# EasyEDA Pro project FX-50FHii_gameboy_Project.epro

# Schematic Schematic1
Create Date: 2024-07-06; Page Name: P1; Project Name: FX-50FHii gameboy; Schematic Name: Schematic1; Update Date: 2024-07-13; Company: 嘉立创EDA; Page Size: A4; Version: V1.0
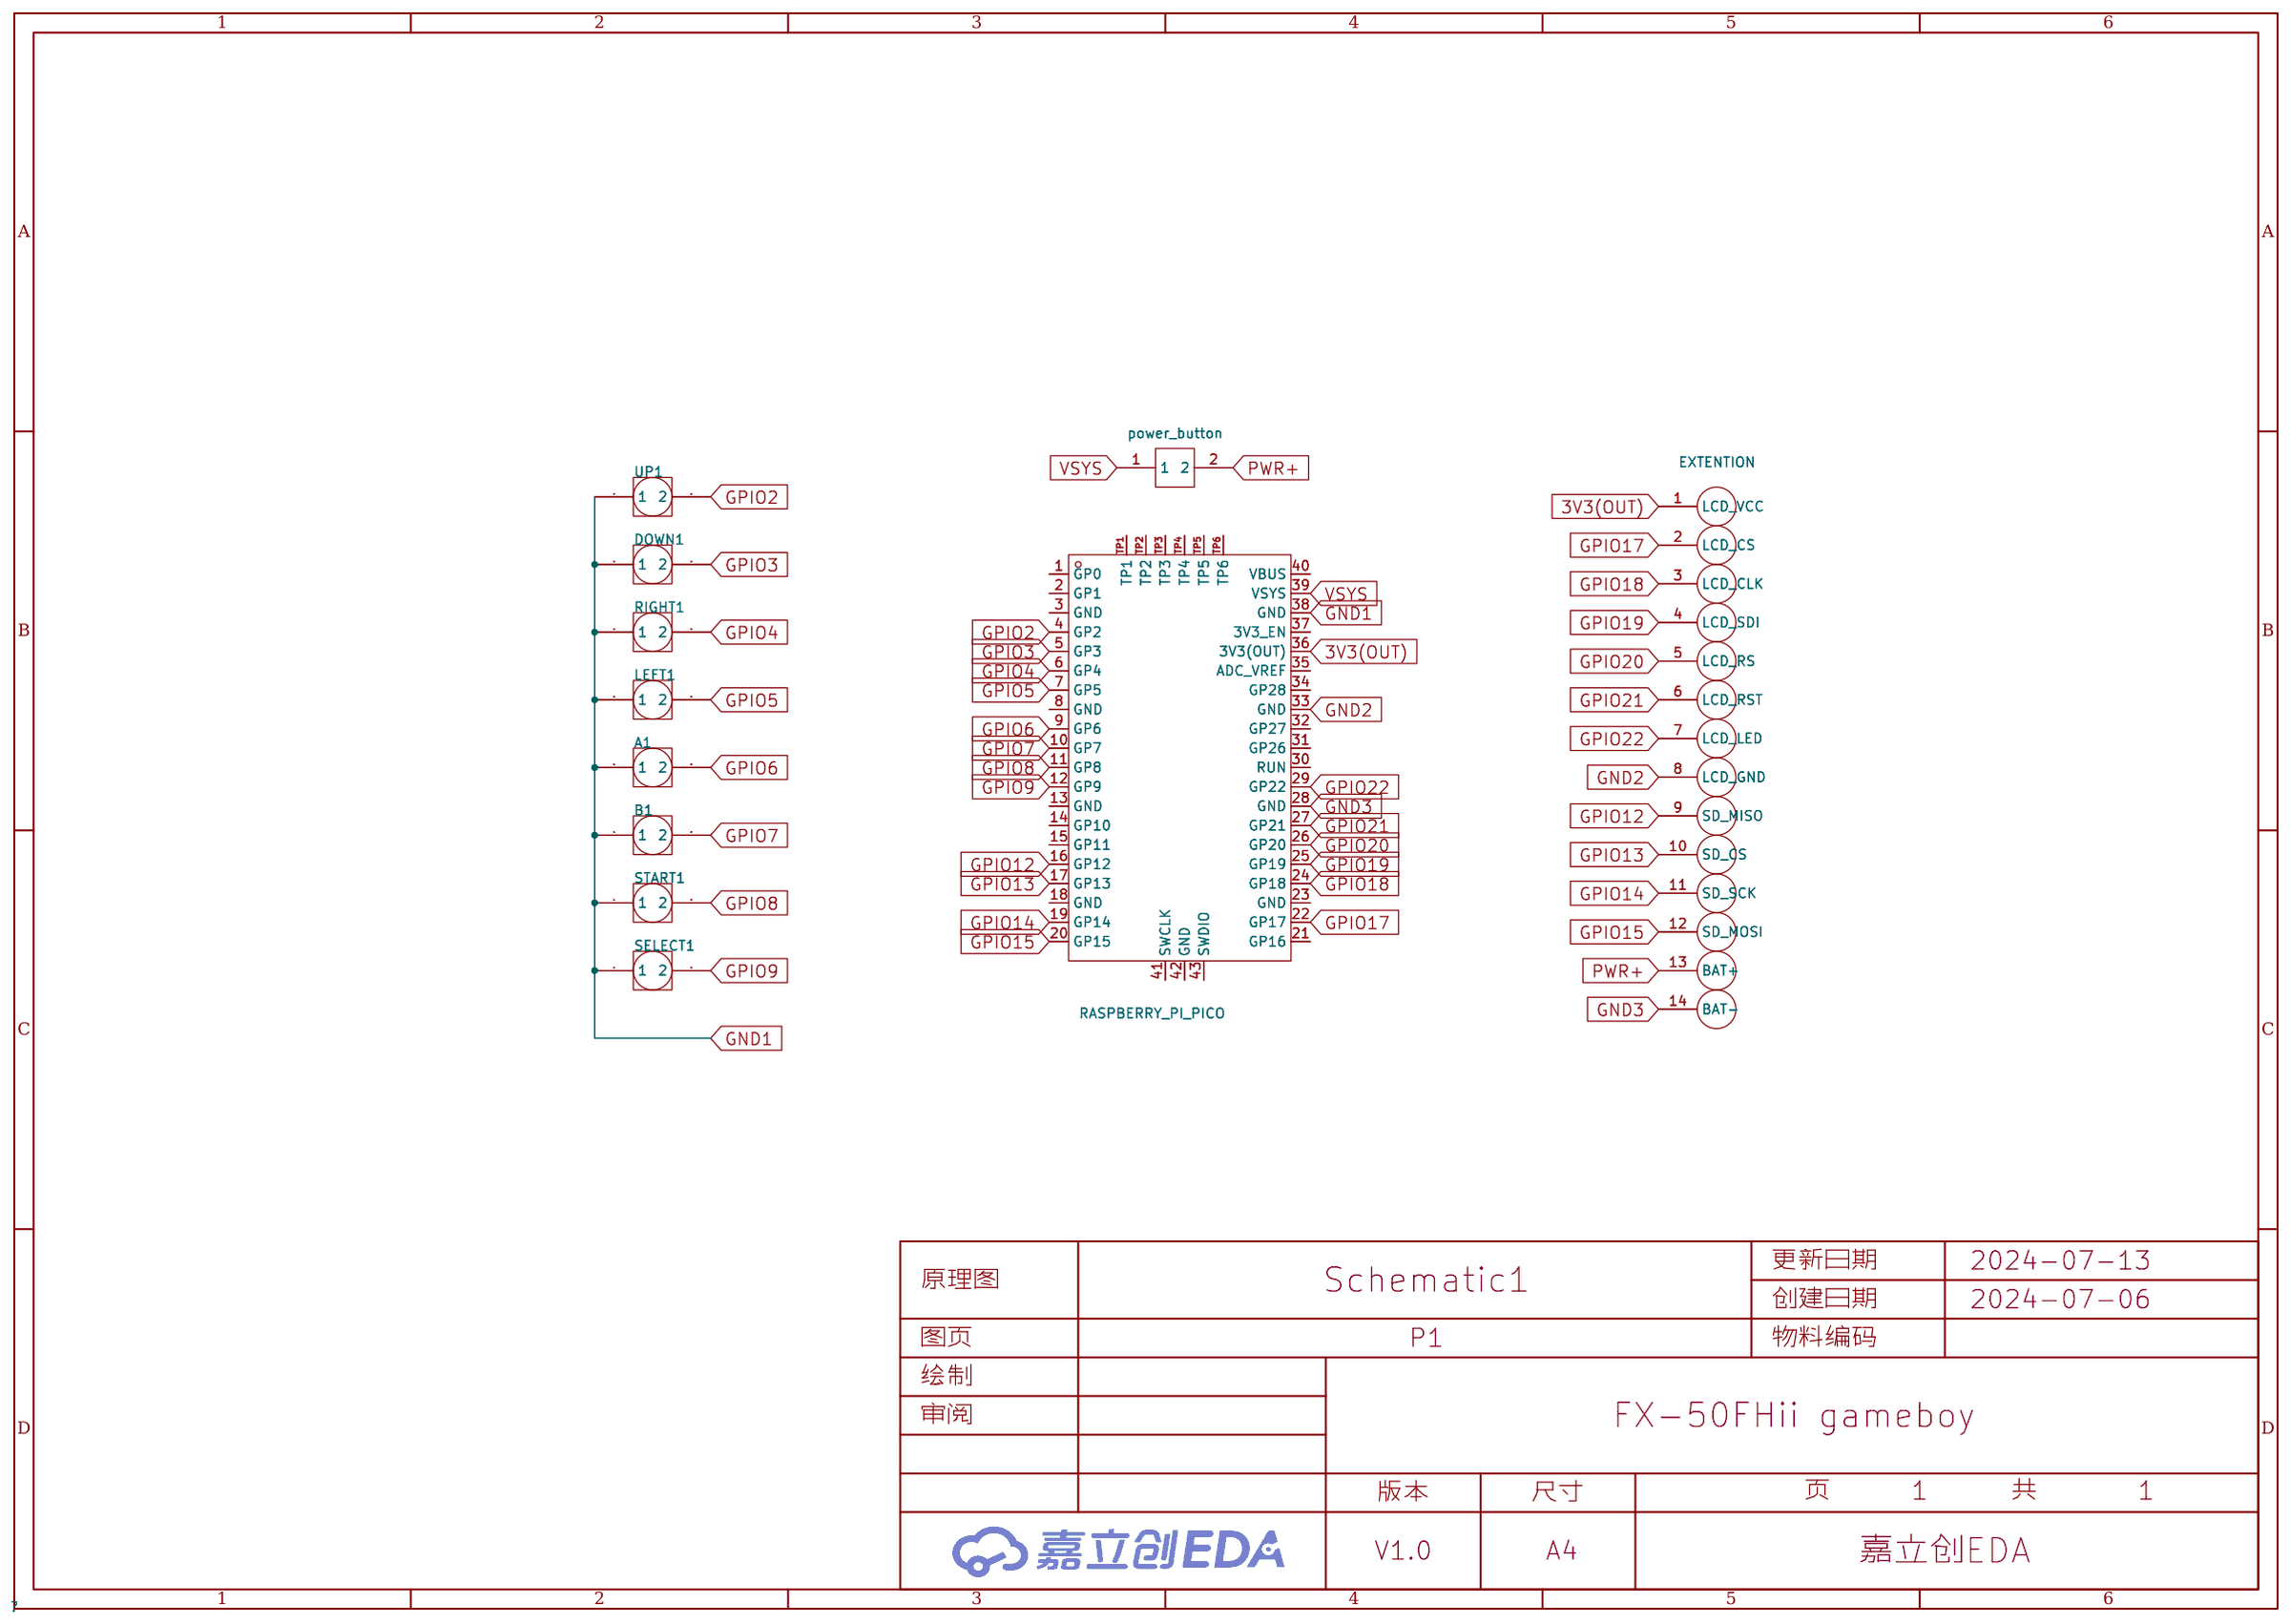
[diagram p0: schematic sheet]

## Parts
A1  -  [锅仔按键]
B1  -  [锅仔按键]
DOWN1  -  [锅仔按键]
EXTENTION  -  [CN1]  (no BOM)
LEFT1  -  [锅仔按键]
power_button  -  [自動鎖住的按鈕]
RASPBERRY_PI_PICO  -  [COMM-SMD_L51.0-W21.0-P2.54_SC0916]
RIGHT1  -  [锅仔按键]
SELECT1  -  [锅仔按键]
START1  -  [锅仔按键]
UP1  -  [锅仔按键]

## Library data of the parts
A1 B1 DOWN1 LEFT1 RIGHT1 SELECT1 START1 UP1 = 锅仔按键
EXTENTION = 焊盤
power_button = 自鎖按鈕
RASPBERRY_PI_PICO = COMM-SMD_L51.0-W21.0-P2.54_SC0916

## Nets
3V3(OUT): EXTENTION.1(LCD_VCC) RASPBERRY_PI_PICO.36(3V3(OUT))
GND1: A1.1 B1.1 DOWN1.1 LEFT1.1 RASPBERRY_PI_PICO.38(GND) RIGHT1.1 SELECT1.1 START1.1 UP1.1
GND2: EXTENTION.8(LCD_GND) RASPBERRY_PI_PICO.33(GND)
GND3: EXTENTION.14(BAT-) RASPBERRY_PI_PICO.28(GND)
GPIO2: RASPBERRY_PI_PICO.4(GP2) UP1.2
GPIO3: DOWN1.2 RASPBERRY_PI_PICO.5(GP3)
GPIO4: RASPBERRY_PI_PICO.6(GP4) RIGHT1.2
GPIO5: LEFT1.2 RASPBERRY_PI_PICO.7(GP5)
GPIO6: A1.2 RASPBERRY_PI_PICO.9(GP6)
GPIO7: B1.2 RASPBERRY_PI_PICO.10(GP7)
GPIO8: RASPBERRY_PI_PICO.11(GP8) START1.2
GPIO9: RASPBERRY_PI_PICO.12(GP9) SELECT1.2
GPIO12: EXTENTION.9(SD_MISO) RASPBERRY_PI_PICO.16(GP12)
GPIO13: EXTENTION.10(SD_CS) RASPBERRY_PI_PICO.17(GP13)
GPIO14: EXTENTION.11(SD_SCK) RASPBERRY_PI_PICO.19(GP14)
GPIO15: EXTENTION.12(SD_MOSI) RASPBERRY_PI_PICO.20(GP15)
GPIO17: EXTENTION.2(LCD_CS) RASPBERRY_PI_PICO.22(GP17)
GPIO18: EXTENTION.3(LCD_CLK) RASPBERRY_PI_PICO.24(GP18)
GPIO19: EXTENTION.4(LCD_SDI) RASPBERRY_PI_PICO.25(GP19)
GPIO20: EXTENTION.5(LCD_RS) RASPBERRY_PI_PICO.26(GP20)
GPIO21: EXTENTION.6(LCD_RST) RASPBERRY_PI_PICO.27(GP21)
GPIO22: EXTENTION.7(LCD_LED) RASPBERRY_PI_PICO.29(GP22)
PWR+: EXTENTION.13(BAT+) power_button.2
VSYS: power_button.1 RASPBERRY_PI_PICO.39(VSYS)

Not connected (* = marked no-connect by the designer): RASPBERRY_PI_PICO 1(GP0) 2(GP1) 3(GND) 8(GND) 13(GND) 14(GP10) 15(GP11) 18(GND) 21(GP16) 23(GND) 30(RUN) 31(GP26) 32(GP27) 34(GP28) 35(ADC_VREF) 37(3V3_EN) 40(VBUS) 41(SWCLK) 42(GND) 43(SWDIO) TP1 TP2 TP3 TP4 TP5 TP6

# Board PCB4
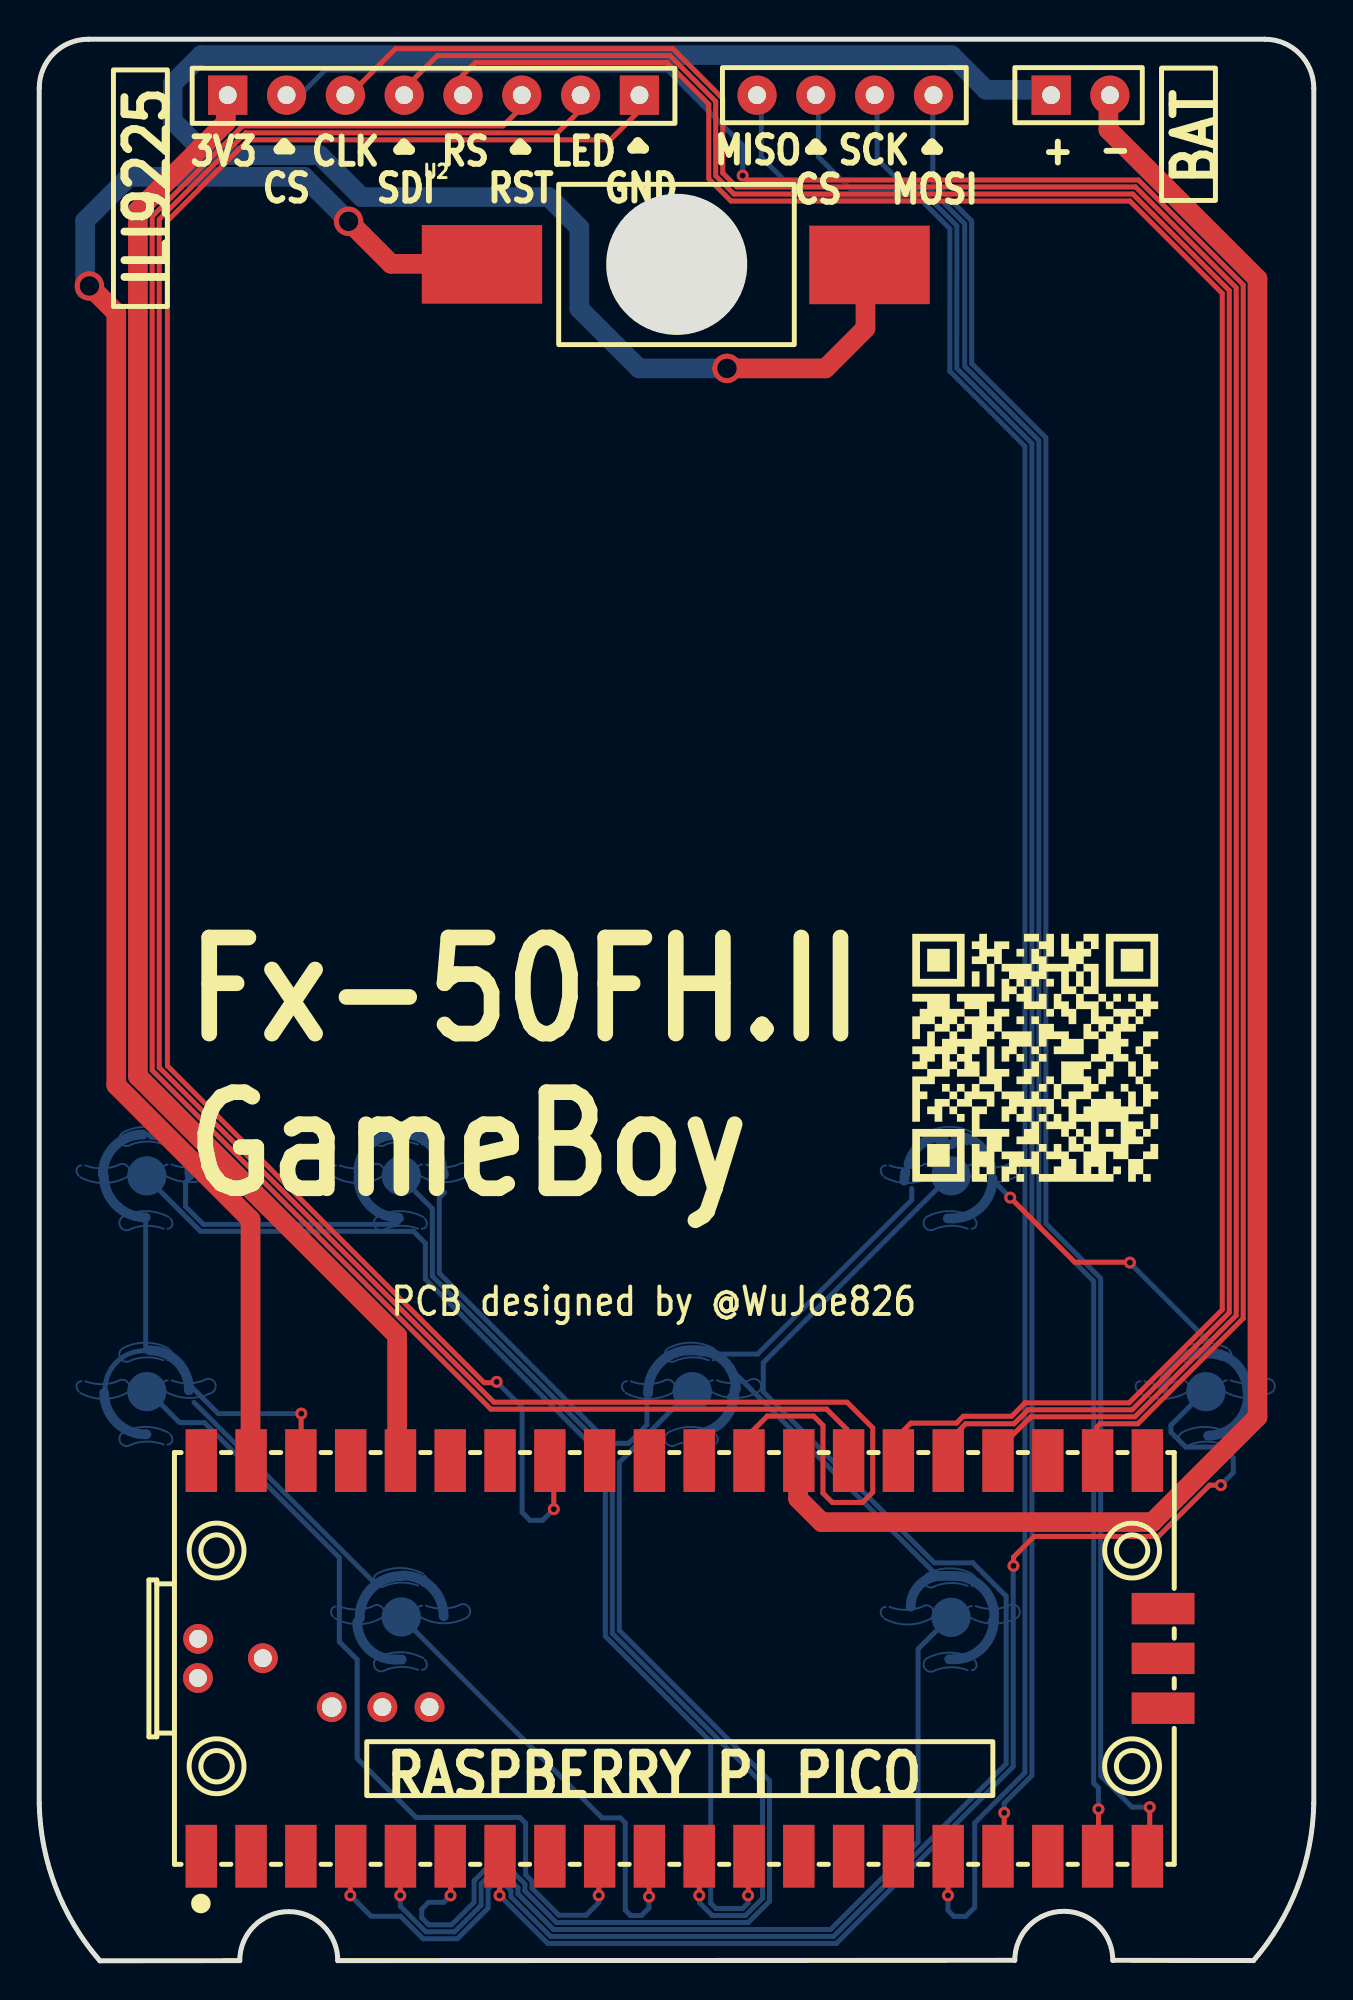
[diagram p1: board, top side]
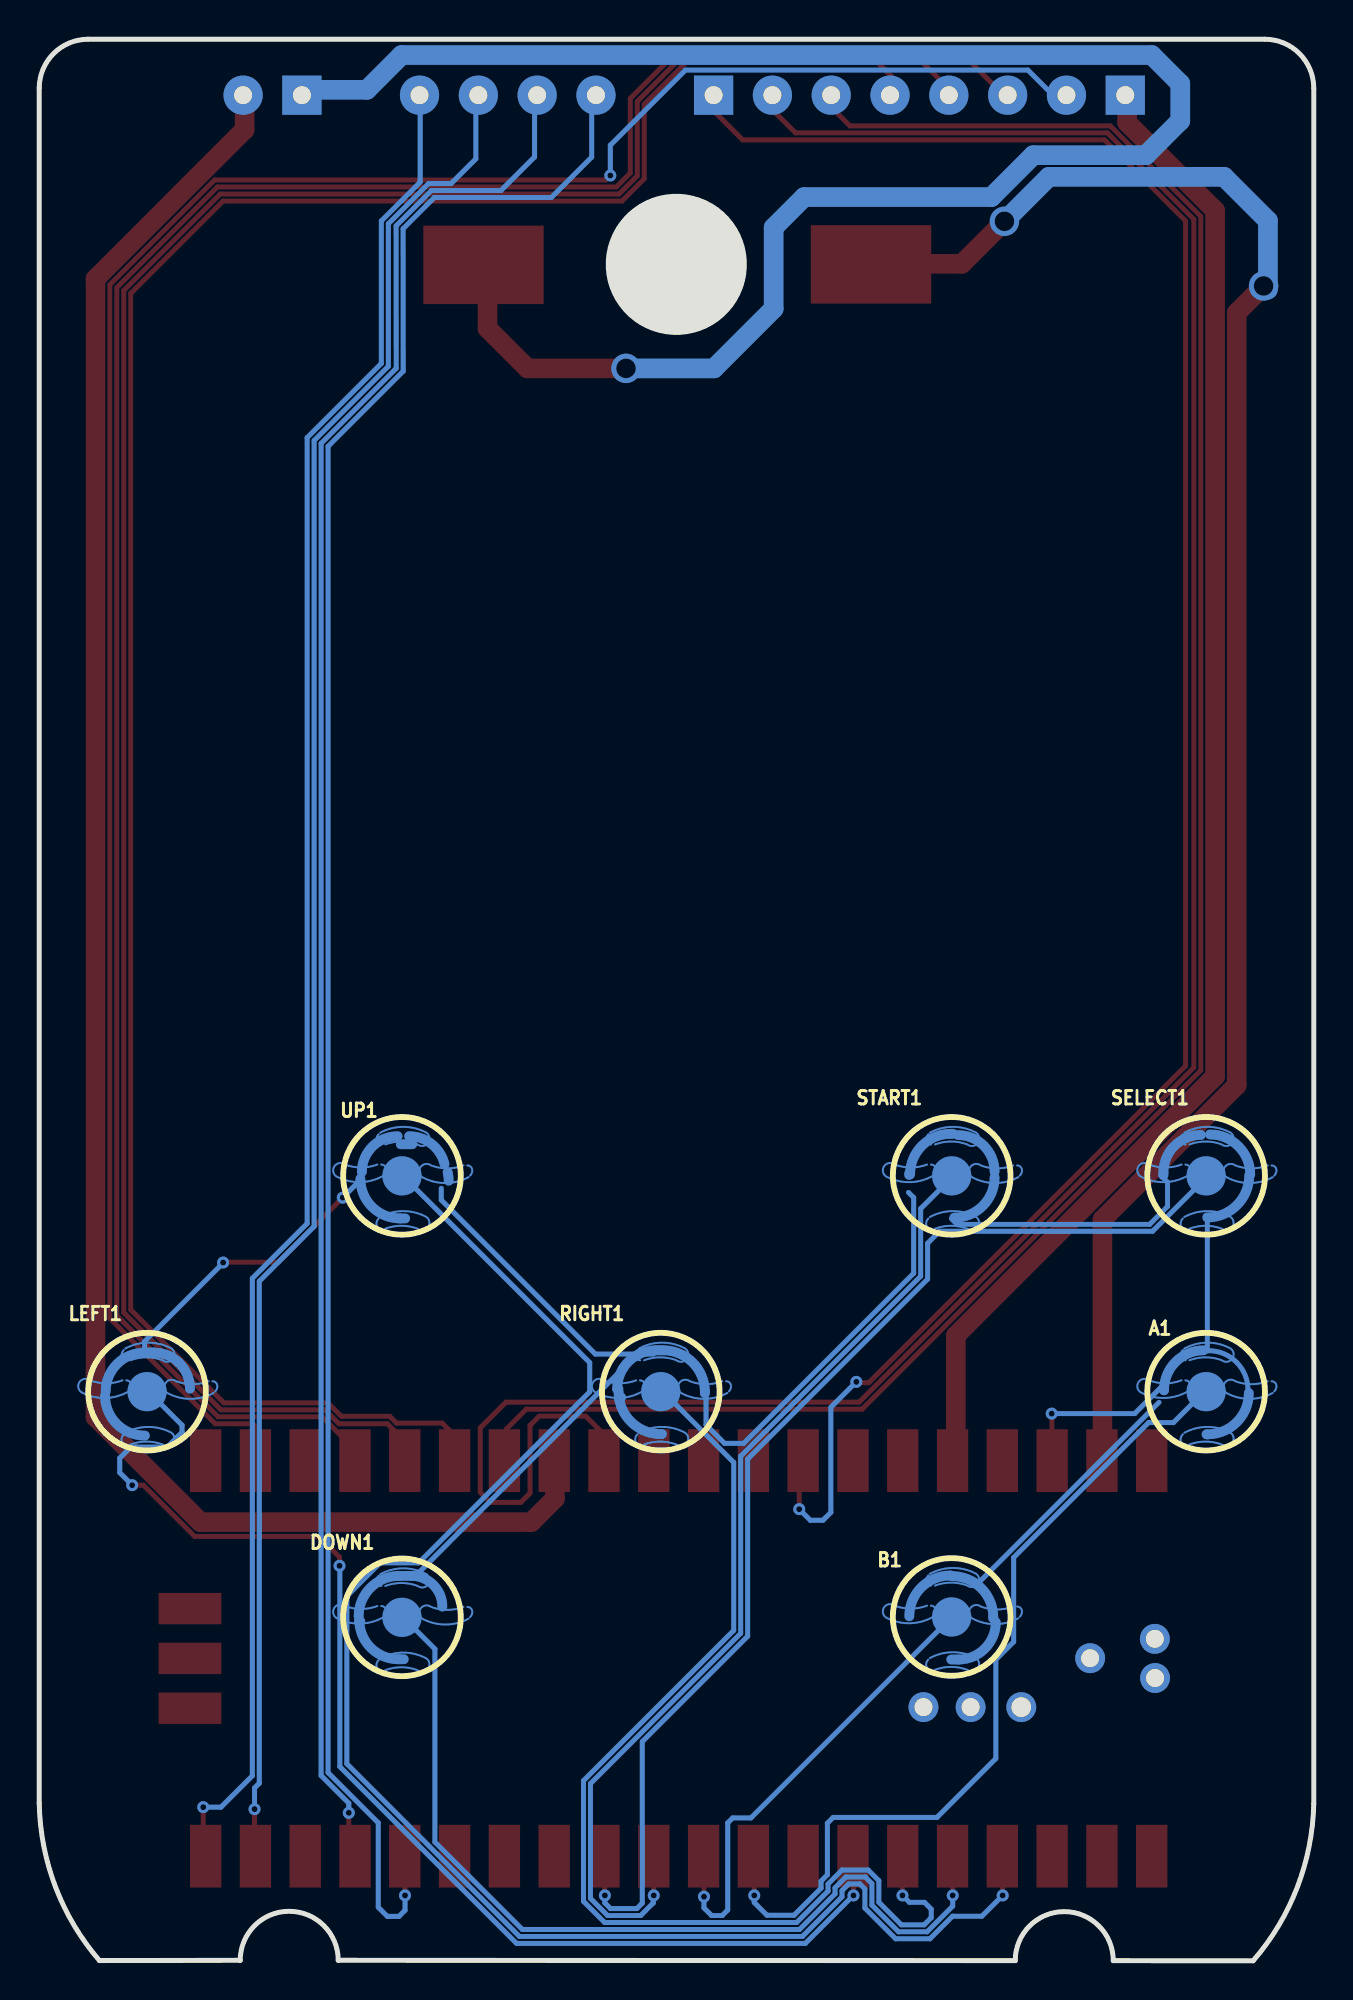
[diagram p2: board, bottom side, seen from below]

Outline 65.02 x 98 mm; copper layers: Top Layer, Bottom Layer. Coordinates in mm from the lower left corner of the outline.
Outline path: 0,95.5 0,8.02 arc(0.85,3.74) 3.09,0 10.23,0.01 arc(12.73,2.51) 15.23,0.01 49.76,0.02 arc(52.26,2.52) 54.76,0.02 61.94,0.01 arc(64.18,3.75) 65.02,8.03 65.02,95.5 arc(64.28,97.27) 62.52,98 2.5,98 arc(0.73,97.27) 0,95.5
Stack: Top Layer 0.035mm / Dielectric1 1.51mm FR4 er 4.5 / Bottom Layer 0.035mm

## Design rules (mm)
template: JLCPCB Capability(Two Layers Board)
spacing copperThickness1oz (default): track to track 0.102, other pairs 0.152 to 0.3
spacing copperThickness2oz: track to track 0.203, other pairs 0.152 to 0.3
track width copperThickness1oz (default): min 0.127, default 0.254, max 2.54
track width copperThickness2oz: min 0.203, default 0.254, max 2.54
differential pair differentialPair (default): width min 0.127, default 0.254, max 2.54; gap min 0.152, default 0.152
via viaSize (default): diameter min 0.5, default 0.61, max 10; hole min 0.3, default 0.305, max 6.3

## Placement (name value [footprint] x y rotation side)
A1  -  [锅仔按键]  5.49 29.03 180 bottom
B1  -  [锅仔按键]  18.47 17.54 180 bottom
DOWN1  -  [锅仔按键]  46.51 17.52 180 bottom
EXTENTION  -  [CN1]  13.62 95.15 0 top
LEFT1  -  [锅仔按键]  59.52 29.03 180 bottom
RASPBERRYPIPICO  -  [COMM-SMD_L51.0-W21.0-P2.54_SC0916]  32.71 15.42 0 top
RIGHT1  -  [锅仔按键]  33.31 29.03 180 bottom
SELECT1  -  [锅仔按键]  5.49 40.03 180 bottom
START1  -  [锅仔按键]  18.47 40.03 180 bottom
U2  -  [自動鎖住的按鈕]  32.52 86.52 0 top
UP1  -  [锅仔按键]  46.51 40.03 180 bottom

## Footprints (pads in the part's own frame, mm; a bottom-side part is the same pattern mirrored in y, then rotated)
CN1
  rect 2x2 hole 0.914: 1(-4,0) 8(17,0) 13(38,0)
  round 2 hole 0.914: 2(-1,0) 3(2,0) 4(5,0) 5(8,0) 6(11,0) 7(14,0) 9(23,0) 10(26,0) 11(29,0) 12(32,0) 14(41,0)
COMM-SMD_L51.0-W21.0-P2.54_SC0916
  rect 1.6x3.2 smd: 1(-24.445,-10.088) 2(-21.905,-10.088) 3(-19.365,-10.088) 4(-16.825,-10.088) 5(-14.285,-10.088) 6(-11.745,-10.088) 7(-9.205,-10.088) 8(-6.665,-10.088) 9(-4.125,-10.088) 10(-1.585,-10.088) 11(0.955,-10.088) 12(3.495,-10.088) 13(6.035,-10.088) 14(8.575,-10.088) 15(11.115,-10.088) 16(13.655,-10.088) 17(16.195,-10.088) 18(18.735,-10.088) 19(21.275,-10.088) 20(23.815,-10.088) 21(23.815,10.088) 22(21.275,10.088) 23(18.735,10.088) 24(16.195,10.088) 25(13.655,10.088) 26(11.115,10.088) 27(8.575,10.088) 28(6.035,10.088) 29(3.495,10.088) 30(0.955,10.088) 31(-1.585,10.088) 32(-4.125,10.088) 33(-6.665,10.088) 34(-9.205,10.088) 35(-11.745,10.088) 36(-14.285,10.088) 37(-16.825,10.088) 38(-19.365,10.088) 39(-21.905,10.088) 40(-24.445,10.088)
  rect 3.2x1.6 smd: 41(24.615,-2.54) 42(24.615,0) 43(24.615,2.54)
  round 1.524 hole 0.914: TP1(-21.303,0.011) TP2(-24.605,0.998) TP3(-24.615,-1) TP5(-15.207,-2.485) TP6(-12.802,-2.484)
  round 1.524 hole 1x0.914: TP4(-17.791,-2.485)
自動鎖住的按鈕
  custom 6.139x4.003 smd: 1(-9.931,-0.002) 2(9.834,-0.028)
锅仔按键
  custom 2.704x0.976 smd: 1(-2.159,0.053) 1(0.05,-2.174) 1(0.052,2.123)
  custom 2.703x0.976 smd: 1(2.236,0.008)
  round 2 smd: 2(0,0)

## Nets
3V3(OUT): EXTENTION.1 RASPBERRYPIPICO.36
GND1: A1.1 B1.1 DOWN1.1 LEFT1.1 RASPBERRYPIPICO.38 RIGHT1.1 SELECT1.1 START1.1 UP1.1
GND2: EXTENTION.8 RASPBERRYPIPICO.33
GND3: EXTENTION.14 RASPBERRYPIPICO.28
GPIO2: RASPBERRYPIPICO.4 UP1.2
GPIO3: DOWN1.2 RASPBERRYPIPICO.5
GPIO4: RASPBERRYPIPICO.6 RIGHT1.2
GPIO5: LEFT1.2 RASPBERRYPIPICO.7
GPIO6: A1.2 RASPBERRYPIPICO.9
GPIO7: B1.2 RASPBERRYPIPICO.10
GPIO8: RASPBERRYPIPICO.11 START1.2
GPIO9: RASPBERRYPIPICO.12 SELECT1.2
GPIO12: EXTENTION.9 RASPBERRYPIPICO.16
GPIO13: EXTENTION.10 RASPBERRYPIPICO.17
GPIO14: EXTENTION.11 RASPBERRYPIPICO.19
GPIO15: EXTENTION.12 RASPBERRYPIPICO.20
GPIO17: EXTENTION.2 RASPBERRYPIPICO.22
GPIO18: EXTENTION.3 RASPBERRYPIPICO.24
GPIO19: EXTENTION.4 RASPBERRYPIPICO.25
GPIO20: EXTENTION.5 RASPBERRYPIPICO.26
GPIO21: EXTENTION.6 RASPBERRYPIPICO.27
GPIO22: EXTENTION.7 RASPBERRYPIPICO.29
PWR+: EXTENTION.13 U2.2
VSYS: RASPBERRYPIPICO.39 U2.1

Pads without a net: RASPBERRYPIPICO 1 2 3 8 13 14 15 18 21 23 30 31 32 34 35 37 40 41 42 43 TP1 TP2 TP3 TP4 TP5 TP6

## Via types
v1: diameter 0.61, hole 0.305, Top Layer to Bottom Layer, 20 vias
v2: diameter 1.5, hole 1, Top Layer to Bottom Layer, 3 vias

## Routing (per net, layer and track width the routed paths; a pad name or vN(x,y) marks a point on that pad's centre or on a via; arc(x,y) is an arc through that point)
3V3(OUT): length 75.6
  Top Layer w1: 18.26,26.49 18.26,31.88 5.03,45.11 5.03,89.26 9.52,93.75 9.52,94.72
GND1: length 185.5
  Top Layer w0.254: 13.36,26.22 13.36,27.84 ; v1(49.53,38.92) 52.83,35.63 55.45,35.63
  Bottom Layer w0.25: 48.63,39.73 48.61,39.75 48.63,39.77 ; 5.52,37.98 5.43,37.89 5.43,31.11 5.36,31.11 arc(3.94,30.53) 3.36,29.11 ; 44.18,40.22 44.29,40.12 ; 18.48,37.84 18.2,37.56 8.37,37.56 7.46,38.47 7.46,39.71 7.81,40.06 ; 7.89,28.48 17.18,19.19
  Bottom Layer w0.254: v1(13.37,27.91) 9.13,27.91 7.66,29.39 ; 59.64,31.02 59.64,31.58 55.63,35.59 v1(55.63,35.61) ; 45.86,19.58 35.23,30.22 ; 31,28.89 31,27.33 30.06,26.39 29.08,26.39 20.41,35.06 20.41,38.92 20.67,39.18 ; 44.51,39.39 44.51,38.8 36.65,30.94 33.68,30.94 ; v1(49.53,38.92) 48.65,39.8 48.65,40.04 ; 20.62,40.15 20.64,40.15 ; 33.41,31.13 33.4,31.12 ; 57.35,29.39 57.34,29.39
  Bottom Layer w0.5: 35.43,28.64 35.33,28.74 ; 35.43,28.64 arc(35.45,28.83) 35.46,29.01 ; 35.43,28.64 arc(34.7,27.37) 33.31,26.86 33.25,26.86 ; 46.42,15.38 46.69,15.38 arc(48.08,15.94) 48.69,17.3 ; 7.67,40.06 7.67,40.21 arc(7.11,41.56) 5.76,42.12 ; 48.69,17.3 48.63,17.3 ; 48.69,17.3 arc(48.69,17.34) 48.69,17.38 ; 35.47,29.17 35.53,29.17 arc(35.46,29.72) 35.23,30.22 arc(34.87,30.64) 34.41,30.94 arc(34,31.09) 33.57,31.13 33.19,31.13 arc(31.68,30.51) 31.06,29.01 31.06,28.95 ; 46.57,41.64 45.99,41.64 ; 18.51,19.65 18.55,19.65 arc(20.02,19.04) 20.63,17.57 ; 18.41,42.18 18.52,42.18 arc(19.99,41.57) 20.59,40.11 ; 46.35,37.86 46.61,37.86 arc(47.99,38.4) 48.63,39.73 ; 18.49,15.36 18.13,15.36 arc(16.78,15.92) 16.22,17.27 ; 16.35,17.46 16.35,17.52 arc(16.57,18.46) 17.18,19.19 arc(17.78,19.51) 18.44,19.62 ; 5.47,26.85 5.42,26.85 arc(3.93,27.47) 3.31,28.95 ; 7.64,29.09 7.64,29.11 arc(7.05,30.54) 5.62,31.13 ; 44.13,39.79 arc(44.14,40.01) 44.18,40.22 ; 16.28,40.25 arc(16.83,41.56) 18.14,42.11 ; 18.33,37.9 arc(16.88,38.5) 16.28,39.95 ; 44.34,40.63 arc(45,41.66) 46.15,42.05 ; 61.62,29.04 arc(61.04,30.44) 59.64,31.02 59.17,31.02 arc(58.48,30.89) 57.89,30.51 arc(57.52,30) 57.34,29.39 arc(57.33,29.29) 57.33,29.18 ; 44.45,18.06 arc(44.85,19.1) 45.83,19.62 arc(45.92,19.63) 46.02,19.63 46.66,19.63 arc(48.12,19.03) 48.72,17.57 ; 46.73,42.05 arc(48.02,41.52) 48.56,40.23 ; 5.43,37.91 arc(3.92,38.54) 3.29,40.05 ; 3.24,40.09 arc(3.84,41.54) 5.29,42.14 ; 20.64,40.15 arc(20.64,40.12) 20.64,40.08 ; 61.66,28.81 arc(61.06,27.38) 59.63,26.78 ; 48.63,39.88 arc(48.63,39.83) 48.63,39.77
GND2: length 105.5
  Top Layer w0.254: 23.27,29.48 22.7,29.48 6.54,45.64 6.54,88.73 10.67,92.87 29.13,92.87 30.7,94.44 30.7,94.94 ; v1(26.25,23.03) 26.25,25.32 25.96,25.61
  Bottom Layer w0.254: v1(23.33,29.53) 24.63,28.23 24.63,22.87 25.04,22.47 25.68,22.47 v1(26.25,23.03)
GND3: length 98.9
  Top Layer w1: 38.91,25.32 38.71,25.12 38.71,23.57 39.91,22.37 56.79,22.37 62.14,27.73 62.14,85.78 54.54,93.38 54.54,95.53
GPIO2: length 83.6
  Top Layer w0.254: RASPBERRYPIPICO.4 v1(15.87,3.33)
  Bottom Layer w0.254: 46.85,39.86 46.28,39.86 36.93,30.51 36.93,29.02 45.66,20.29 47.62,20.29 49.33,18.59 49.33,10.05 40.52,1.24 26.09,1.24 24.06,3.26 24.06,3.58 23.72,3.92 23.15,3.92 22.9,3.66 22.9,2.69 21.33,1.12 19.58,1.12 18.43,2.27 16.93,2.27 v1(15.87,3.33)
GPIO3: length 46.5
  Top Layer w0.254: 18.44,5.33 v1(18.42,3.33)
  Bottom Layer w0.254: 46.41,17.31 46.24,17.31 44.83,15.9 44.83,6.06 40.37,1.6 26.23,1.6 24.42,3.41 24.42,3.72 23.87,4.27 22.88,4.27 22.54,3.94 22.54,2.84 21.18,1.48 19.73,1.48 18.42,2.79 v1(18.42,3.33)
GPIO4: length 56.5
  Top Layer w0.254: v1(20.98,3.33) 21,5.33
  Bottom Layer w0.254: 33.41,28.92 33.09,28.92 29.59,25.42 29.59,16.85 37.25,9.18 37.25,3.04 36.17,1.95 26.38,1.95 24.78,3.56 24.78,3.92 24.06,4.63 22.73,4.63 22.19,4.09 22.19,2.98 21.03,1.83 19.87,1.83 19.51,2.19 19.51,2.64 19.86,2.98 20.63,2.98 v1(20.98,3.33)
GPIO5: length 63.9
  Top Layer w0.254: 23.5,5.33 v1(23.48,3.33) ; v1(49.7,20.14) 49.7,20.59 50.75,21.64 57.09,21.64 59.7,24.26 v1(60.28,24.26)
  Bottom Layer w0.254: 59.66,28.9 59.32,28.9 57.73,27.32 57.73,26.96 58.49,26.2 60.35,26.2 60.91,25.64 60.91,24.9 60.32,24.31 ; v1(23.48,3.33) 23.49,3.33 25.94,0.89 40.66,0.89 49.68,9.9 49.68,20.03
GPIO6: length 43.9
  Top Layer w0.254: 28.56,5.33 v1(28.54,3.33)
  Bottom Layer w0.254: 5.59,29.01 7.16,27.45 8.43,27.45 15.31,20.56 15.31,16.27 16.22,15.36 16.22,10.31 19.22,7.31 24.52,7.31 24.81,7.02 24.81,4.38 25.13,4.06 25.13,3.7 26.51,2.32 27.89,2.32 28.54,2.97 v1(28.54,3.33)
GPIO7: length 24.4
  Top Layer w0.254: 31.12,5.27 v1(31.11,3.27)
  Bottom Layer w0.254: v1(31.11,3.27) 31.11,2.7 30.72,2.31 30.18,2.31 29.89,2.59 29.89,7.03 29.64,7.29 28.71,7.29 18.6,17.4 18.6,17.7
GPIO8: length 50.1
  Top Layer w0.254: 33.69,5.33 v1(33.67,3.33)
  Bottom Layer w0.254: 18.97,39.62 18.97,39.44 20.05,38.36 20.05,34.91 29.23,25.73 29.23,16.7 36.9,9.04 36.9,3.18 36.02,2.31 34.33,2.31 33.69,2.95 33.69,3.31 v1(33.67,3.33)
GPIO9: length 60
  Top Layer w0.254: 36.19,5.33 36.17,3.33
  Bottom Layer w0.254: 5.41,40.1 5.41,40.02 8.22,37.2 19.09,37.2 19.7,36.59 19.7,34.77 28.88,25.59 28.88,16.55 34.25,11.18 34.25,2.94 34.53,2.66 35.87,2.66 36.16,2.95 v1(36.16,3.33)
GPIO12: length 106.9
  Top Layer w0.254: 46.37,5.33 v1(46.36,3.33)
  Bottom Layer w0.254: v1(46.36,3.33) 46.36,2.57 46.66,2.26 47.26,2.26 47.72,2.73 47.72,7.04 50.28,9.6 50.28,77.24 46.45,81.07 46.45,88.33 44.86,89.93 38.89,89.93 36.83,91.98 36.83,95.04
GPIO13: length 97
  Top Layer w0.254: v1(49.22,7.55) 49.22,5.69 48.87,5.33
  Bottom Layer w0.254: v1(49.22,7.55) 49.22,8.04 50.64,9.45 50.64,77.38 46.8,81.22 46.81,88.48 45.01,90.28 41.46,90.28 39.75,91.99 39.75,94.58 40.05,94.88
GPIO14: length 94.5
  Top Layer w0.254: v1(54.03,7.73) 54.03,5.37 54,5.33
  Bottom Layer w0.254: v1(54.03,7.73) 54.03,8.81 53.79,9.06 53.79,34.66 50.99,37.45 50.99,77.53 47.21,81.32 47.21,88.59 45.16,90.64 44,90.64 42.74,91.9 42.74,94.5
GPIO15: length 94.6
  Top Layer w0.254: v1(56.65,7.83) 56.65,5.42 56.56,5.33
  Bottom Layer w0.254: 45.58,94.83 45.58,90.71 47.56,88.73 47.56,81.46 51.35,77.68 51.35,37.6 54.14,34.8 54.14,9.43 55.74,7.83 v1(56.65,7.83)
GPIO17: length 117.5
  Top Layer w0.254: v1(35.88,91.05) 36.11,90.82 56.07,90.82 61.41,85.48 61.41,32.76 56.04,27.39 54.12,27.39 53.95,27.22 53.95,26.75
  Bottom Layer w0.254: 12.76,95.19 13.35,95.19 14.58,96.43 32.05,96.43 35.88,92.59 v1(35.88,91.05)
GPIO18: length 120.8
  Top Layer w0.254: 48.93,26.09 50.58,27.74 55.89,27.74 61.06,32.91 61.06,85.33 55.92,90.46 35.58,90.46 34.87,91.18 34.87,94.98 32.32,97.52 18.18,97.52 15.85,95.18
GPIO19: length 119.4
  Top Layer w0.254: 46.59,26.72 47.26,27.39 49.72,27.39 50.43,28.1 55.74,28.1 60.7,33.06 60.7,85.18 55.78,90.1 35.43,90.1 34.51,91.03 34.51,94.83 32.18,97.16 20.3,97.16 18.4,95.26 18.14,95.26
GPIO20: length 118.2
  Top Layer w0.254: 21.41,95.33 21.41,95.97 22.24,96.81 32.03,96.81 34.15,94.68 34.15,90.88 35.29,89.75 55.63,89.75 60.35,85.04 60.35,33.21 55.59,28.45 50.29,28.45 49.6,27.77 47.14,27.77 46.79,27.42 44.46,27.42 43.69,26.65 43.68,26.65
GPIO21: length 108.9
  Top Layer w0.254: 41.19,26.48 41.19,27.11 40.17,28.13 23.04,28.13 5.76,45.41 5.76,88.96 10.38,93.58 23.66,93.58 25.02,94.93
GPIO22: length 126.3
  Top Layer w0.254: 27.41,95.07 27.41,94.2 26.44,93.22 10.53,93.22 6.12,88.82 6.12,45.56 23.19,28.49 41.2,28.49 42.52,27.18 42.52,23.89 42,23.38 40.45,23.38 39.98,23.85 39.98,27.31 39.51,27.78 37.14,27.78 36.21,26.85 ; 27.6,94.77 27.6,95.32
PWR+: length 94.5
  Top Layer w1: 42.15,86.02 42.15,83.25 40.11,81.21 v2(35.08,81.21)
  Bottom Layer w1: v2(35.08,81.21) 30.59,81.21 27.55,84.26 27.55,88.39 26,89.95 16.44,89.95 14.31,92.08 8.57,92.08 6.81,93.84 6.81,95.74 8.26,97.19 46.53,97.19 48.3,95.42 51.45,95.42
VSYS: length 88.4
  Top Layer w1: v2(2.56,85.42) 3.93,84.05 3.93,44.65 10.78,37.8 10.78,26.3 ; 21.98,86.55 17.95,86.55 v2(15.78,88.71)
  Bottom Layer w1: 2.34,85.23 2.34,88.74 4.58,90.98 13.51,90.98 v2(15.78,88.71)

## Copper pours and planes (outline as drawn; the poured copper is in the pictures)
GND1 on Bottom Layer: -4.25,100.65 68.29,100.65 68.29,-4.3 -4.25,-4.3
GND2 on Top Layer: -7.8,103.5 73.66,103.5 73.66,-9.48 -7.8,-9.48

## Text on the board
Top Silkscreen Layer: PCB designed by @WuJoe826 | 3V3 | CS | CLK | SDI | RS | RST | LED | GND | MISO | SCK | MOSI | + | - | RASPBERRY PI PICO | ILI9225 | BAT | Fx-50FH.II / GameBoy
